# Altium schematic sheet nusense-user-io.schdoc: NUSense
size A4; Organization: Elby Designs; Address1: 9 Follan Close; Address2: Kariong; Address3: NSW 2250; Address4: Australia; Revision: 1; SheetNumber: 5; SheetTotal: 9; DrawnBy: User Interface; Engineer: Laurie Biddulph; PageSetup: Record=PageOptions|CenterHorizontal=True|CenterVertical=True|PrintScale=1.38|XCorrection=1.00|YCorrection=1.00|PrintKind=1|BorderSize=5000000|LeftOffset=0|BottomOffset=0|Orientation=2|PaperLength=1000|PaperWidth=1000|Scale=100|PaperSource=7|PrintQuality=-4|MediaType=1|DitherType=10|PaperKind=A3|PrintScaleMode=1
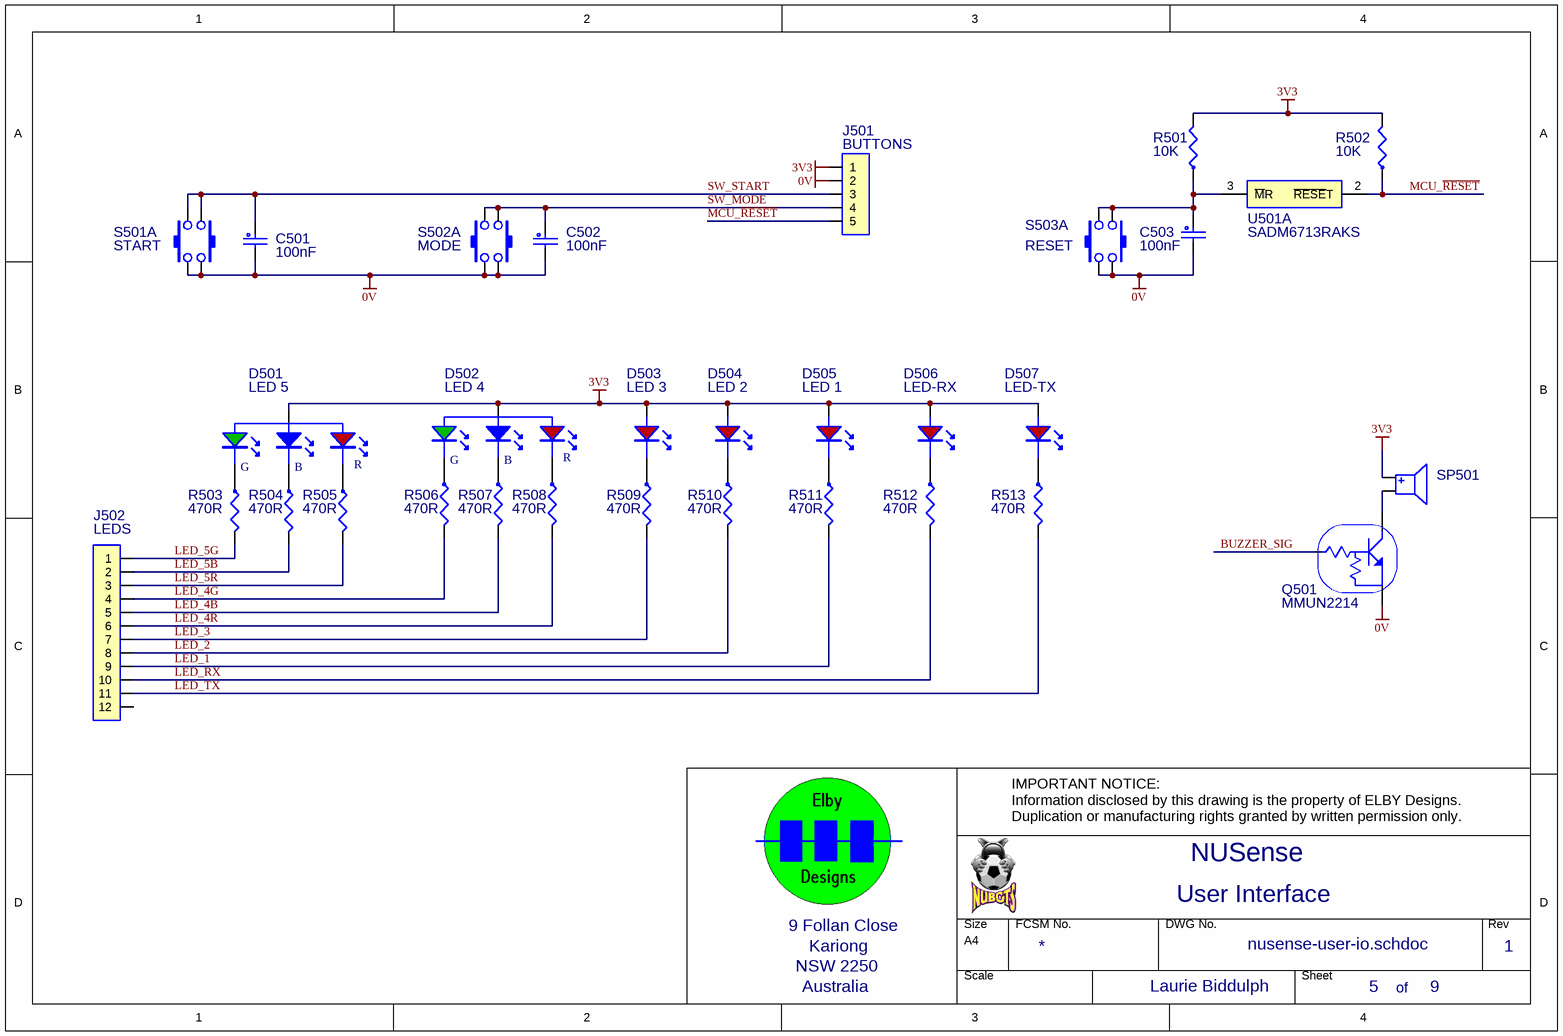
[diagram p0: nusense-user-io.schdoc]

## Parts
C501  100nF  [RAD-0.2N(LB)]
C502  100nF  [RAD-0.2N(LB)]
C503  100nF  [RAD-0.2N(LB)]
D501  LED 5  [LED-RGB(LB)]
D502  LED 4  [LED-RGB(LB)]
D503  LED 3  [LED-PCB(LB)]
D504  LED 2  [LED-PCB(LB)]
D505  LED 1  [LED-PCB(LB)]
D506  LED-RX  [LED-PCB(LB)]
D507  LED-TX  [LED-PCB(LB)]
J501  BUTTONS  [TERM254-5(LB)]
J502  LEDS
Q501  MMUN2214  [SOT-23(LB)]
R501  10K  [AXIAL-0.4(LB)]
R502  10K  [AXIAL-0.4(LB)]
R503  470R  [AXIAL-0.4(LB)]
R504  470R  [AXIAL-0.4(LB)]
R505  470R  [AXIAL-0.4(LB)]
R506  470R  [AXIAL-0.4(LB)]
R507  470R  [AXIAL-0.4(LB)]
R508  470R  [AXIAL-0.4(LB)]
R509  470R  [AXIAL-0.4(LB)]
R510  470R  [AXIAL-0.4(LB)]
R511  470R  [AXIAL-0.4(LB)]
R512  470R  [AXIAL-0.4(LB)]
R513  470R  [AXIAL-0.4(LB)]
S501  START  [PCB-PB(LB)]  (parts A,B of 2)
S502  MODE  [PCB-PB(LB)]  (parts A,B of 2)
S503  RESET  [PCB-PB(LB)]  (parts A,B of 2)
SP501  *  [MTA-2V(LB)]  (value not drawn)
U501  SADM6713RAKS  (part A of 2)

## Nets
0V: C501.2 C502.2 C503.2 J501.2 Q501.2(E) S501.1(COM) S501.3(COM) S502.1(COM) S502.3(COM) S503.1(COM) S503.3(COM)
3V3: D501.1(A) D502.1(A) D503.A D504.A D505.A D506.A D507.A J501.1 R501.2 R502.2 SP501.1
BUZZER_SIG: Q501.1(B)
LED_1: J502.9 R511.2
LED_2: J502.8 R510.2
LED_3: J502.7 R509.2
LED_4B: J502.5 R507.2
LED_4G: J502.4 R506.2
LED_4R: J502.6 R508.2
LED_5B: J502.2 R504.2
LED_5G: J502.1 R503.2
LED_5R: J502.3 R505.2
LED_RX: J502.10 R512.2
LED_TX: J502.11 R513.2
MCU_~{RESET}: J501.5 R502.1 U501.2(~{RESE}T)
SW_MODE: C502.1 J501.4 S502.2(NO) S502.4(NO)
SW_START: C501.1 J501.3 S501.2(NO) S501.4(NO)
NetC503_1: C503.1 R501.1 S503.2(NO) S503.4(NO) U501.3(~{M}R)
NetD501_2: D501.2(KG) R503.1
NetD501_3: D501.3(KB) R504.1
NetD501_4: D501.4(KR) R505.1
NetD502_2: D502.2(KG) R506.1
NetD502_3: D502.3(KB) R507.1
NetD502_4: D502.4(KR) R508.1
NetD503_K: D503.K R509.1
NetD504_K: D504.K R510.1
NetD505_K: D505.K R511.1
NetD506_K: D506.K R512.1
NetD507_K: D507.K R513.1
NetQ501_3: Q501.3(C) SP501.2

Not connected (* = marked no-connect by the designer): J502 12

## Notes on the sheet
- IMPORTANT NOTICE:
  Information disclosed by this drawing is the property of ELBY Designs.
  Duplication or manufacturing rights granted by written permission only.
- of
- (in symbol LED-RGB-CA(LB)) R; G; B

## Library data of the parts
C501-C503 = CC-100NF(LB): Monolithic Ceramic; EMRP: CC-100NF
D501 D502 = LED-RGB-CA(LB): RGB LED
D503-D507 = LED-RED(LB): LED
J501 = CON5(LB)
J502 = CON12(LB)
Q501 = MMUN2214LT1(SMD): NPN Digital Transistor; EMRP: SM-T-MMUN2214LT1
R501 R502 = RM-10K(LB): 0.5W 1% Metal Film Resistor; EMRP: RM-10K
R503-R513 = RM-470R(LB): 0.5W 1% Metal Film Resistor; EMRP: RM-470R
S501-S503 = SW-PB-DPST(LB)
SP501 = SPEAKER(LB): Text Field1: OriginalName SPEAKER; Text Field2: Description
U501 = ADM6713